# Altium schematic sheet Altium-Schematic.SchDoc
size 400 x 209 mm; SheetNumber: 1; SheetTotal: 1
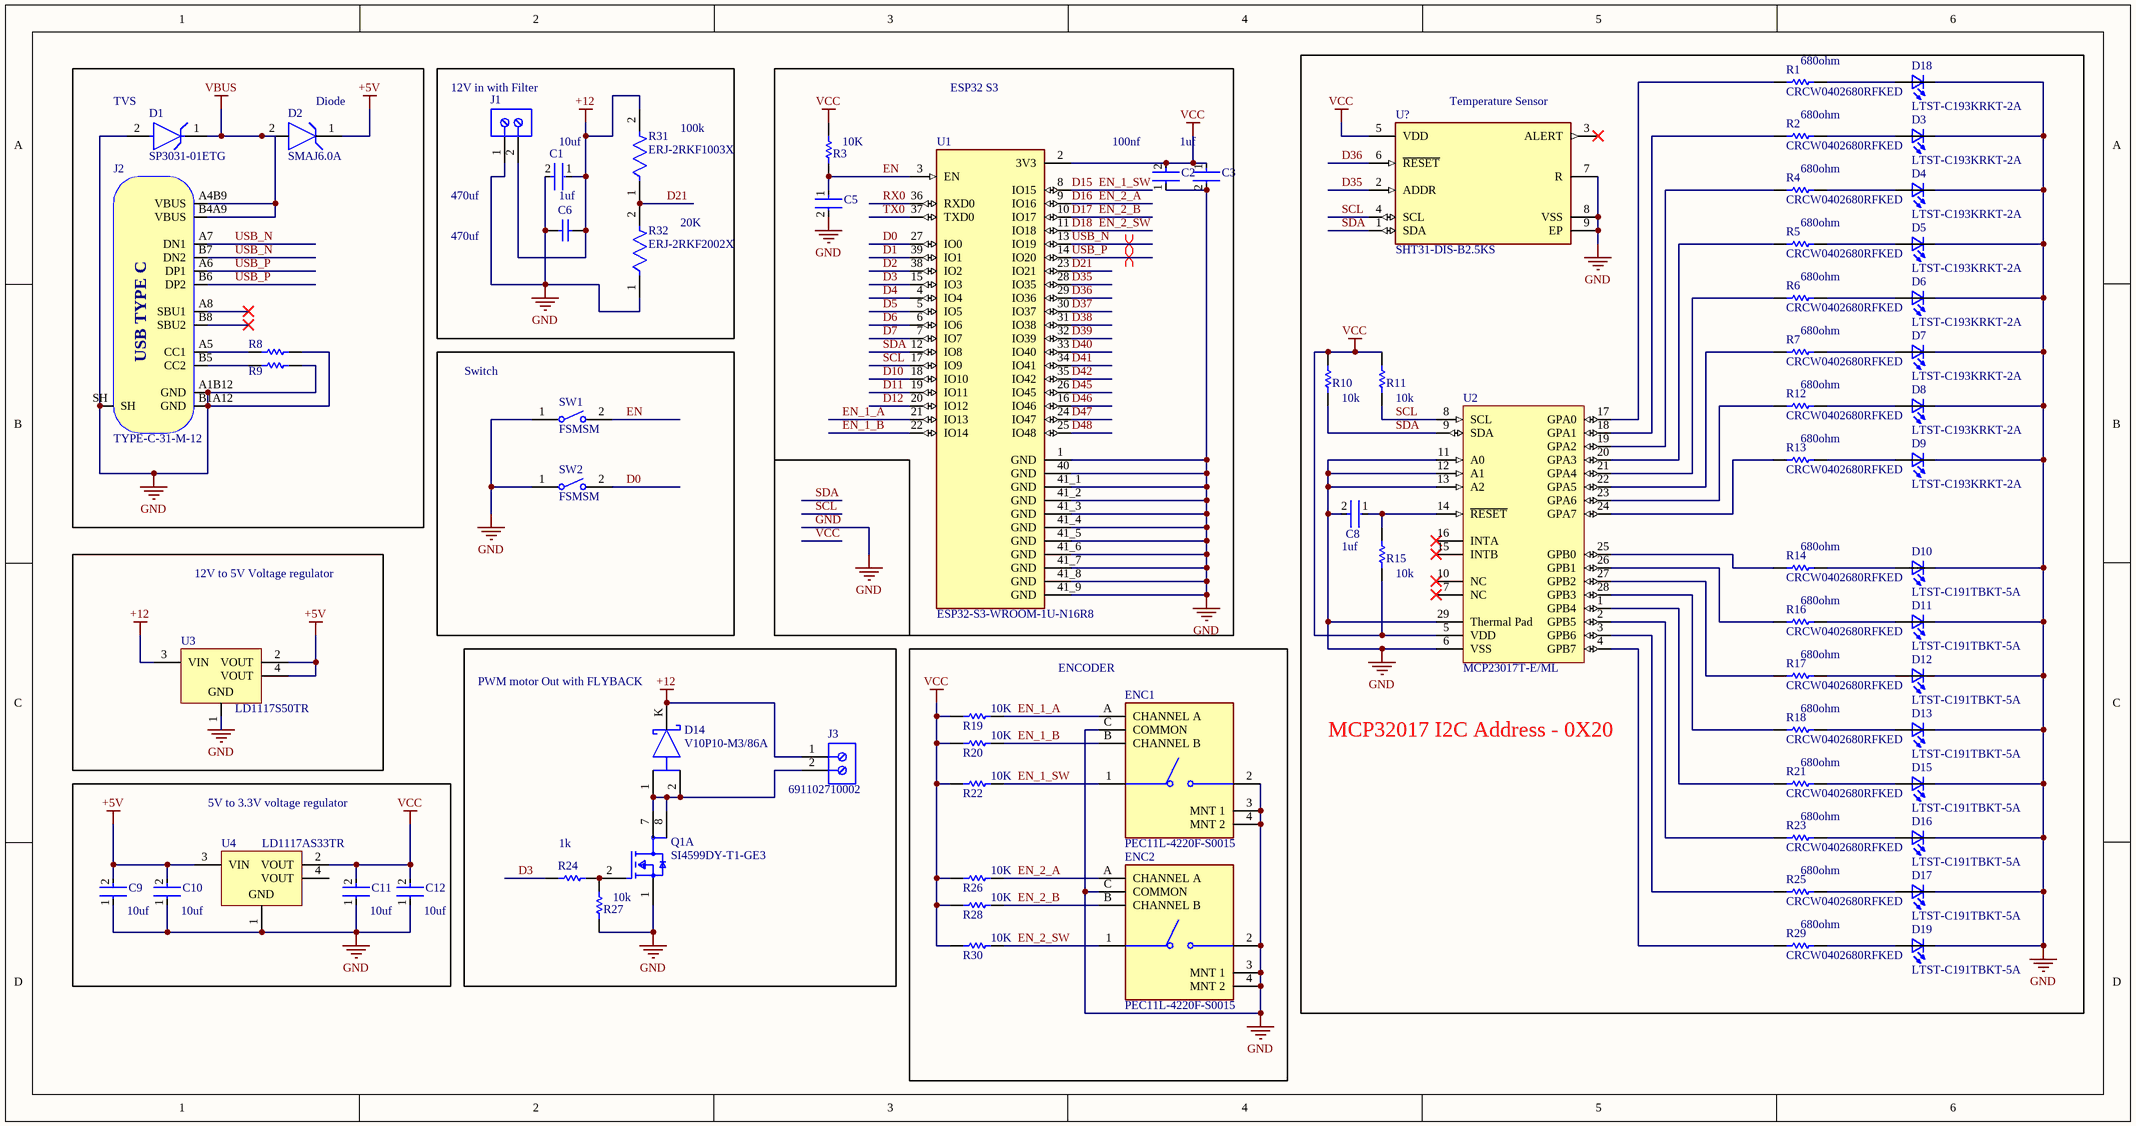
[diagram p0: Altium-Schematic.SchDoc]

## Parts
C1  C1608X5R1A106K080AC  [FP-C1608-080-0_1-MFG]  (value not drawn)
C2  GRM155R71C104KA88D  [FP-GRM15-MFG]  (value not drawn)
C3  EMK105BJ105KV-F  [FP-0402-L_1_0_0_05-W_0_5-IPC_A]  (value not drawn)
C5  EMK105BJ105KV-F  [FP-0402-L_1_0_0_05-W_0_5-IPC_A]  (value not drawn)
C6  C0603C105K4RACTU  [CAPC1608X90X35LL15T15]  (value not drawn)
C8  GRM155R71C104KA88D  [FP-GRM15-MFG]  (value not drawn)
C9  C1608X5R1A106K080AC  [FP-C1608-080-0_1-MFG]  (value not drawn)
C10  C1608X5R1A106K080AC  [FP-C1608-080-0_1-MFG]  (value not drawn)
C11  C1608X5R1A106K080AC  [FP-C1608-080-0_1-MFG]  (value not drawn)
C12  C1608X5R1A106K080AC  [FP-C1608-080-0_1-MFG]  (value not drawn)
D1  SP3031-01ETG  [FP-SP3031-MFG]
D2  SMAJ6.0A  [FP-SMA-MFG]
D3  LTST-C193KRKT-2A  [0603]
D4  LTST-C193KRKT-2A  [0603]
D5  LTST-C193KRKT-2A  [0603]
D6  LTST-C193KRKT-2A  [0603]
D7  LTST-C193KRKT-2A  [0603]
D8  LTST-C193KRKT-2A  [0603]
D9  LTST-C193KRKT-2A  [0603]
D10  LTST-C191TBKT-5A  [0603]
D11  LTST-C191TBKT-5A  [0603]
D12  LTST-C191TBKT-5A  [0603]
D13  LTST-C191TBKT-5A  [0603]
D14  V10P10-M3/86A  [FP-95570-MFG]
D15  LTST-C191TBKT-5A  [0603]
D16  LTST-C191TBKT-5A  [0603]
D17  LTST-C191TBKT-5A  [0603]
D18  LTST-C193KRKT-2A  [0603]
D19  LTST-C191TBKT-5A  [0603]
ENC1  PEC11L-4220F-S0015  [FP-PEC11L-4220F-S0015-MFG]
ENC2  PEC11L-4220F-S0015  [FP-PEC11L-4220F-S0015-MFG]
J1  691102710002  [691102710002]  (value not drawn)
J2  TYPE-C-31-M-12  [TYPE-C-31-M-12]
J3  691102710002  [691102710002]
Q1  SI4599DY-T1-GE3  [FP-C-06527-IPC_B]  (part A of 2)
R1  CRCW0402680RFKED  [RESC1005X40X25ML05T05]
R2  CRCW0402680RFKED  [RESC1005X40X25ML05T05]
R3  ERJ-2GEJ103X  [RESC1005X40X25ML05T05]  (value not drawn)
R4  CRCW0402680RFKED  [RESC1005X40X25ML05T05]
R5  CRCW0402680RFKED  [RESC1005X40X25ML05T05]
R6  CRCW0402680RFKED  [RESC1005X40X25ML05T05]
R7  CRCW0402680RFKED  [RESC1005X40X25ML05T05]
R8  RC0402FR-075K1L  [RESC1005X40X25NL05T10]  (value not drawn)
R9  RC0402FR-075K1L  [RESC1005X40X25NL05T10]  (value not drawn)
R10  ERJ-2GEJ103X  [RESC1005X40X25ML05T05]  (value not drawn)
R11  ERJ-2GEJ103X  [RESC1005X40X25ML05T05]  (value not drawn)
R12  CRCW0402680RFKED  [RESC1005X40X25ML05T05]
R13  CRCW0402680RFKED  [RESC1005X40X25ML05T05]
R14  CRCW0402680RFKED  [RESC1005X40X25ML05T05]
R15  ERJ-2GEJ103X  [RESC1005X40X25ML05T05]  (value not drawn)
R16  CRCW0402680RFKED  [RESC1005X40X25ML05T05]
R17  CRCW0402680RFKED  [RESC1005X40X25ML05T05]
R18  CRCW0402680RFKED  [RESC1005X40X25ML05T05]
R19  ERJ-2GEJ103X  [RESC1005X40X25ML05T05]  (value not drawn)
R20  ERJ-2GEJ103X  [RESC1005X40X25ML05T05]  (value not drawn)
R21  CRCW0402680RFKED  [RESC1005X40X25ML05T05]
R22  ERJ-2GEJ103X  [RESC1005X40X25ML05T05]  (value not drawn)
R23  CRCW0402680RFKED  [RESC1005X40X25ML05T05]
R24  ERJ-2GEJ102X  [RESC1005X40X25NL05T05]  (value not drawn)
R25  CRCW0402680RFKED  [RESC1005X40X25ML05T05]
R26  ERJ-2GEJ103X  [RESC1005X40X25ML05T05]  (value not drawn)
R27  ERJ-2GEJ103X  [RESC1005X40X25ML05T05]  (value not drawn)
R28  ERJ-2GEJ103X  [RESC1005X40X25ML05T05]  (value not drawn)
R29  CRCW0402680RFKED  [RESC1005X40X25ML05T05]
R30  ERJ-2GEJ103X  [RESC1005X40X25ML05T05]  (value not drawn)
R31  ERJ-2RKF1003X  [FP-ERJ2RK-IPC_C]
R32  ERJ-2RKF2002X  [FP-ERJ2RK-MFG]
SW1  FSMSM  [TECO-FSMSM-2_V]
SW2  FSMSM  [TECO-FSMSM-2_V]
U1  ESP32-S3-WROOM-1U-N16R8  [XCVR_ESP32-S3-WROOM-1U-N16R8]
U2  MCP23017T-E/ML  [QFN-ML28_M]
U3  LD1117S50TR  [SOT-223_L]
U4  LD1117AS33TR  [SOT-223_M]
U?  SHT31-DIS-B2.5KS  [FP-SHT31-DIS-B2_5KS-MFG]

## Blocks framed on the sheet
MCP32017 I2C Address - 0X20: C8 D3-D13 D15-D19 R1 R2 R4-R7 R10-R18 R21 R23 R25 R29 U2 U?
Switch: SW1 SW2
12V to 5V Voltage regulator: U3

## Nets
+5V: C9.2 C10.2 D2.1(C) U3.2(VOUT) U3.4(VOUT) U4.3(VIN)
+12: C1.1 C6.2 D14.K(C) J1.2 J3.1 R31.2 U3.3(VIN)
GND: C1.2 C2.1 C3.2 C5.2 C6.1 C8.2 C9.1 C10.1 C11.1 C12.1 D1.2(A) D3.1(K2) D4.1(K2) D5.1(K2) D6.1(K2) D7.1(K2) D8.1(K2) D9.1(K2) D10.1(K2) D11.1(K2) D12.1(K2) D13.1(K2) D15.1(K2) D16.1(K2) D17.1(K2) D18.1(K2) D19.1(K2) ENC1.2 ENC1.3(MNT_1) ENC1.4(MNT_2) ENC1.C(COMMON) ENC2.2 ENC2.3(MNT_1) ENC2.4(MNT_2) ENC2.C(COMMON) J1.1 J2.A1B12(GND) J2.B1A12(GND) J2.SH Q1.1(S1) R8.2 R9.2 R27.1 R32.1 SW1.1 SW2.1 U1.1(GND) U1.40(GND) U1.41_1(GND) U1.41_2(GND) U1.41_3(GND) U1.41_4(GND) U1.41_5(GND) U1.41_6(GND) U1.41_7(GND) U1.41_8(GND) U1.41_9(GND) U2.6(VSS) U2.11(A0) U2.12(A1) U2.13(A2) U2.29(Thermal_Pad) U3.1(GND) U4.1(GND) U?.7(R) U?.8(VSS) U?.9(EP)
VBUS: D1.1(C) D2.2(A) J2.A4B9(VBUS) J2.B4A9(VBUS)
VCC: C2.2 C3.1 C11.2 C12.2 R3.2 R10.2 R11.2 R15.1 R19.2 R20.2 R22.2 R26.2 R28.2 R30.2 U1.2(3V3) U2.5(VDD) U4.2(VOUT) U?.5(VDD)
D0: SW2.2 U1.27(IO0)
D1: U1.39(IO1)
D2: U1.38(IO2)
D3: R24.1 U1.15(IO3)
D4: U1.4(IO4)
D5: U1.5(IO5)
D6: U1.6(IO6)
D7: U1.7(IO7)
D10: U1.18(IO10)
D11: U1.19(IO11)
D12: U1.20(IO12)
D15: ENC1.1 R22.1 U1.8(IO15)  [also labelled EN_1_SW]
D16: ENC2.A(CHANNEL_A) R26.1 U1.9(IO16)  [also labelled EN_2_A]
D17: ENC2.B(CHANNEL_B) R28.1 U1.10(IO17)  [also labelled EN_2_B]
D18: ENC2.1 R30.1 U1.11(IO18)  [also labelled EN_2_SW]
D21: R31.1 R32.2 U1.23(IO21)
D35: U1.28(IO35) U?.2(ADDR)
D36: U1.29(IO36) U?.6(~{RESET})
D37: U1.30(IO37)
D38: U1.31(IO38)
D39: U1.32(IO39)
D40: U1.33(IO40)
D41: U1.34(IO41)
D42: U1.35(IO42)
D45: U1.26(IO45)
D46: U1.16(IO46)
D47: U1.24(IO47)
D48: U1.25(IO48)
EN: C5.1 R3.1 SW1.2 U1.3(EN)
EN_1_A: ENC1.A(CHANNEL_A) R19.1 U1.21(IO13)
EN_1_B: ENC1.B(CHANNEL_B) R20.1 U1.22(IO14)
RX0: U1.36(RXD0)
SCL: R11.1 U1.17(IO9) U2.8(SCL) U?.4(SCL)
SDA: R10.1 U1.12(IO8) U2.9(SDA) U?.1(SDA)
TX0: U1.37(TXD0)
USB_N: J2.A7(DN1) J2.B7(DN2) U1.13(IO19)
USB_P: J2.A6(DP1) J2.B6(DP2) U1.14(IO20)
NetC8_1: C8.1 R15.2 U2.14(~{RESET})
NetD3_2: D3.2(A2) R2.2
NetD4_2: D4.2(A2) R4.2
NetD5_2: D5.2(A2) R5.2
NetD6_2: D6.2(A2) R6.2
NetD7_2: D7.2(A2) R7.2
NetD8_2: D8.2(A2) R12.2
NetD9_2: D9.2(A2) R13.2
NetD10_2: D10.2(A2) R14.2
NetD11_2: D11.2(A2) R16.2
NetD12_2: D12.2(A2) R17.2
NetD13_2: D13.2(A2) R18.2
NetD14_1: D14.1(A) D14.2(A) J3.2 Q1.7(D1) Q1.8(D1)
NetD15_2: D15.2(A2) R21.2
NetD16_2: D16.2(A2) R23.2
NetD17_2: D17.2(A2) R25.2
NetD18_2: D18.2(A2) R1.2
NetD19_2: D19.2(A2) R29.2
NetJ2_A5: J2.A5(CC1) R8.1
NetJ2_B5: J2.B5(CC2) R9.1
NetQ1_2: Q1.2(G1) R24.2 R27.2
NetR1_1: R1.1 U2.17(GPA0)
NetR2_1: R2.1 U2.18(GPA1)
NetR4_1: R4.1 U2.19(GPA2)
NetR5_1: R5.1 U2.20(GPA3)
NetR6_1: R6.1 U2.21(GPA4)
NetR7_1: R7.1 U2.22(GPA5)
NetR12_1: R12.1 U2.23(GPA6)
NetR13_1: R13.1 U2.24(GPA7)
NetR14_1: R14.1 U2.25(GPB0)
NetR16_1: R16.1 U2.26(GPB1)
NetR17_1: R17.1 U2.27(GPB2)
NetR18_1: R18.1 U2.28(GPB3)
NetR21_1: R21.1 U2.1(GPB4)
NetR23_1: R23.1 U2.2(GPB5)
NetR25_1: R25.1 U2.3(GPB6)
NetR29_1: R29.1 U2.4(GPB7)

Not connected (* = marked no-connect by the designer): J2 A8(SBU1)* B8(SBU2)*; U2 7(NC)* 10(NC)* 15(INTB)* 16(INTA)*; U4 4(VOUT); U? 3(ALERT)*

## Layout directives
differential pair: USB_N, USB_P

## Notes on the sheet
- (near R1) 680ohm
- (near D1) TVS
- (near D2) Diode
- (near J1) 12V in with Filter
- (near R31) 100k
- ESP32 S3
- (near U?) Temperature Sensor
- (near R2) 680ohm
- 470uf
- 10uf
- (near C1) 1uf
- (near R3) 10K
- (near C2) 100nf
- 1uf
- (near R4) 680ohm
- 20K
- (near R5) 680ohm
- (near R6) 680ohm
- (near R7) 680ohm
- 10k
- (near R11) 10k
- (near R12) 680ohm
- (near R13) 680ohm
- (near R15) 10k
- (near R14) 680ohm
- (near R16) 680ohm
- ENCODER
- (near R17) 680ohm
- (near D14) PWM motor Out with FLYBACK
- (near R19) 10K
- (near R20) 10K
- (near R18) 680ohm
- 5V to 3.3V voltage regulator
- (near R22) 10K
- (near R21) 680ohm
- (near R24) 1k
- (near R26) 10K
- (near R23) 680ohm
- (near R25) 680ohm
- (near C12) 10uf
- (near R28) 10K
- (near R30) 10K
- (near R29) 680ohm
- (in symbol TYPE-C-31-M-12) USB TYPE C

## Library data of the parts
C1 C9-C12 = CMP-2000-04979-3: Multilayer Ceramic Capacitors 10μF ±10% 10V X5R SMD 0603; Capacitance: 10uF; Dielectric Material: Ceramic; Construction: Flat; Height: 0.8mm; Thickness: 0.035inch; Case Code (Metric): 1608; Radiation Hardening: No; Number of Pins: 2; Voltage Rating (DC): 10V; Depth: 0.8mm; Voltage: 10V; RoHS Compliant: Yes; Voltage Rating: 10V; Package Quantity: 1; Resistor Type: Ceramic; Termination: SMD/SMT; Lead Free: Lead Free; REACH SVHC: No SVHC; Tolerance: 10%; Mount: Surface Mount; Series: C; Packaging: Tape and Reel; Width: 0.8mm; Dielectric: X5R; Weight: 7.1E-05oz; Length: 1.6mm; Max Operating Temperature: 85°C; Case Code (Imperial): 0603; Case/Package: 0603; Min Operating Temperature: -55°C
C2 C8 = CMP-2100-03641-2: CAP CER 0.1UF 16V X7R 0402; Manufacturer: Murata; Standoff Height: 0mm; Tolerance: 10%; Voltage Rating: 16Vdc; Material: Ceramic; Capacitance: 0.10μF; Value: 0.10μF; RoHS: TRUE; Manufacturer Part Number: GRM155R71C104KA88D; Temperature Characteristic: X7R; Octopart: https://octopart.com/grm155r71c104ka88d-murata-196880; Digikey Description: CAP CER 0.1UF 16V X7R 0402; Device Class L3: Ceramic Capacitors; Height: 0.55mm; ComponentLink2Description: Datasheet; Temperature Range Low: -55°C; Ipc Land Pattern Name: CAPC10050X219; ComponentLink2URL: https://search.murata.co.jp/Ceramy/image/img/A01X/G101/ENG/GRM155R71H471KA01-01A.pdf; Device Class L1: Passive Components; Lead Free: yes; Category: Cap; Package: GRM15; Temperature: -55°C to +125°C; Device Class L2: Capacitors; Temperature Range High: +125°C; Mouser Description: 0402 0.1 uF 16V ±10 % Tolerance X7R SMT Multilayer Ceramic Capacitor
C3 C5 = CMP-14477-000104-2: None; Tolerance: 10%; Voltage Rating: 16V; Dielectric: X5R; Capacitance: 1uF; Packaging: Tape and Reel; Depth: 0.5mm; Mount: Surface Mount; Thickness: 0.022inch; Package Quantity: 1; Min Operating Temperature: -55°C; Series: M; Voltage Rating (DC): 16V; Termination: SMD/SMT; Case/Package: 0402; Number of Pins: 2; Case Code (Imperial): 0402; Length: 1mm; Halogen Free: Halogen Free; Case Code (Metric): 1005; Width: 0.02inch; RoHS Compliant: Yes; Radiation Hardening: No; Max Operating Temperature: 85°C; Height: 0.5mm; Construction: Flat
C6 = CMP-2006-02298-2: Manufacturer: Kemet; Part Number: C0603C105K4RACTU
D1 = CMP-08607-000052-1: TVS DIODE 5V 7.5V SOD882; Manufacturer: Littelfuse Inc; Capacitance: 0.8pF; Number Of Channels: 1; Value: 0.8pF; Automotive Grade: Grade 1; Direction: Unidirectional; Peak Pulse Current: 5A; Breakdown Voltage: 6V; Device Class L2: TVS Diodes; Temperature: -40°C to +125°C; ComponentLink2Description: Datasheet; Device Class L3: unset; Height: 0.6mm; RoHS: TRUE; Device Class L1: Circuit Protection; Reverse Standoff Voltage: 5V; Octopart: https://octopart.com/sp3031-01etg-littelfuse-22577615; Category: Diode; Lead Free: Yes; Manufacturer Part Number: SP3031-01ETG; Package: SP3031; Temperature Range High: +125°C; Automotive: Yes; Mouser Description: SP3031 Series 6 V 0.8 pF Uni-Directional TVS Diode Array - SOD-882; ComponentLink2URL: https://www.littelfuse.com/~/media/electronics/datasheets/tvs_diode_arrays/littelfuse_tvs_diode_array_sp3031_datasheet.pdf.pdf; Digikey Description: TVS DIODE 5V 7.5V SOD882; Temperature Range Low: -40°C; Clamping Voltage: 7.5V
D2 = CMP-07401-000002-1: TVS DIODE 6V 10.3V SMA; Manufacturer: Bourns Inc.; Max Junction Temp: +150°C; Peak Pulse Power: 400W; Breakdown Voltage: 6.67V; Peak Pulse Current: 38.8A; Direction: Unidirectional; Number Of Channels: 1; Clamping Voltage: 10.3V; Digikey Description: TVS DIODE 6V 10.3V SMA; Automotive: No; Octopart: https://octopart.com/smaj6.0a-bourns-12809397; Package: SMA; Temperature Range High: +150°C; Manufacturer Part Number: SMAJ6.0A; Device Class L2: TVS Diodes; Temperature Range Low: -55°C; ComponentLink2URL: https://www.bourns.com/docs/product-datasheets/smaj.pdf?sfvrsn=d2266a96_11; Lead Free: Yes; Device Class L1: Circuit Protection; Mouser Description: Diode TVS Single Uni-Dir 6V 400W 2-Pin SMA T/R; RoHS: TRUE; Height: 2.29mm; Category: Diode; Temperature: -55°C to +150°C; Reverse Standoff Voltage: 6V; ComponentLink2Description: Datasheet; Device Class L3: unset
D3-D9 D18 = LTST-C193KRKT-2A: Red 629nm LED Indication - Discrete 1.9V 0603 _1608 Metric_; MF: Lite-On Inc.; Digi-Key_Part_Number: 160-1909-1-ND; Value: *; MP: LTST-C193KRKT-2A; Package: 0603 Lite-On; SnapEDA_Link: https://www.snapeda.com/parts/LTST-C193KRKT-2A/Lite-On%20Inc./view-part/565233/?ref=snap; Digi-Key_Purchase_URL: https://www.digikey.com/product-detail/en/lite-on-inc/LTST-C193KRKT-2A/160-1909-1-ND/3694456?utm_source=snapeda&utm_medium=aggregator&utm_campaign=symbol
D10-D13 D15-D17 D19 = LTST-C191TBKT-5A: Blue 473nm LED Indication - Discrete 2.8V 0603 _1608 Metric_; MF: Lite-On Inc.; Package: 0603 Lite-On; Price: None; Availability: Unavailable; MP: LTST-C191TBKT-5A; SnapEDA_Link: https://www.snapeda.com/parts/LTST-C191TBKT-5A/Lite-On%20Inc./view-part/266129/?ref=snap; Value: *
D14 = CMP-2000-07483-2: DIODE SCHOTTKY 100V 10A TO277A; Manufacturer: Vishay; Max Junction Temp: +175°C; Max Surge Forward Current: 180A; Peak Reverse Current: 30.4uA; Digikey Description: DIODE SCHOTTKY 100V 10A TO277A; Manufacturer Part Number: V10P10-M3/86A; Device Class L1: Discrete Semiconductors; ComponentLink2Description: Datasheet; Reverse Voltage: 100V; Device Class L2: Diodes; Temperature Range Low: -40°C; Automotive: No; Package: 95570; Mouser Description: Diode Schottky 100V 10A 3-Pin(2+Tab) SMPC T/R; Lead Free: Yes; Footprint Url: https://www.vishay.com/docs/95570/to-277asmpc.pdf; Octopart: https://octopart.com/v10p10-m3%2F86a-vishay-42522004; Forward Current: 10A; Device Class L3: Schottky Diodes; RoHS: TRUE; Temperature Range High: +175°C; Temperature: -40°C to +175°C; ComponentLink2URL: http://www.vishay.com/docs/89006/v10p10.pdf; Category: Diode; Max Repetitive Reverse Voltage: 100V; Height: 1.2mm
ENC1 ENC2 = CMP-07421-000002-1: ROTARY ENCODER MECHANICAL 15PPR; Manufacturer: Bourns Inc.; Conn Orientation: Vertical; Voltage Rating Dc: 5V; Detent: Yes; Pulses Per Rev: 15; Current Rating: 10mA; Number Of Circuits: 1; Encoder Type: Incremental; Mouser Description: Encoders FLATTED SHAFT PUSH SWTCH 30DETENTS; Temperature Range High: +80°C; Device Class L1: Electromechanical; Octopart: https://octopart.com/pec11l-4220f-s0015-bourns-19504852; Height: 25.3mm; Device Class L2: Switches; Temperature: -25°C to +80°C; Device Class L3: Encoders; Lead Free: Yes; Manufacturer Part Number: PEC11L-4220F-S0015; Package: 0; ComponentLink2Description: Datasheet; Automotive: No; ComponentLink2URL: https://www.bourns.com/docs/product-datasheets/pec11l.pdf?sfvrsn=7b1089f1_8; Temperature Range Low: -25°C; Category: Enc; RoHS: TRUE; Digikey Description: ROTARY ENCODER MECHANICAL 15PPR
J1 J3 = CMP-1502-03258-2: NexarPartId: 8917706; Number of Levels: 1; Number of Positions Per Level: 2; Current: 15A; Voltage: 300V; Pitch: 5.0038mm; Plating: Steel; Stripping Length: -6mm; Wire Gauge (Min): 14AWG; Wire Gauge (Max): 22AWG; Length: 7.5mm; Contact Material: Brass; Contact Plating: Tin; Packaging: Box; Number of Pins: 2; Voltage Rating: 300V; Termination: Screw; Number of Contacts: 2; Color: Blue; Current Rating: 15A; Mount: Through Hole; Max Operating Temperature: 105°C; Min Operating Temperature: -40°C; REACH SVHC: Unknown; Height: 13.4mm; Width: 11.2mm; Housing Material: Nylon; RoHS: Compliant; Wire/Cable Gauge: 22AWG; Lead Pitch: 5mm
J2 = TYPE-C-31-M-12: USB Type C Connector Horizontal SMT; Manufacturer: Koren Hroparts; Manufacturer Part Number: TYPE-C-31-M-12
Q1 = CMP-02550-000305-1: MOSFET N/P-CH 40V 6.8A 8SOIC; Number of Elements: 2; Fall Time: 13ns; Input Capacitance: 640pF; Polarity: N-CHANNEL; Turn-On Delay Time: 44ns; Rds On Max: 35.5mR; Turn-Off Delay Time: 30ns; Power Dissipation: 2W; Max Power Dissipation: 3.1W; FET Type: N and P-Channel; Gate to Source Voltage (Vgs): 20V; On-State Resistance: 45mR; Rise Time: 33ns; Drain to Source Resistance: 37mR; Threshold Voltage: 1.4V; Weight: 0.019048oz; Length: 5mm; Max Operating Temperature: 150°C; Min Operating Temperature: -55°C; Continuous Drain Current (ID): 6.8A; Height: 1.55mm; Number of Pins: 8; Mount: Surface Mount; Radiation Hardening: No; Lead Free: Lead Free; Case/Package: SOIC; Packaging: Tape and Reel; Drain to Source Breakdown Voltage: 40V; Series: TrenchFET®; Width: 4mm; Contact Plating: Tin; Drain-source On Resistance-Max: 45mR; RoHS Compliant: Yes; Drain to Source Voltage (Vdss): 40V; Package Quantity: 2500; Number of Channels: 2
R1 R2 R4-R7 R12-R14 R16-R18 R21 R23 R25 R29 = CMP-2002-00166-1: Manufacturer: Vishay Dale; Part Number: CRCW0402680RFKED
R3 R10 R11 R15 R19 R20 R22 R26-R28 R30 = CMP-2002-00433-1: Manufacturer: Panasonic; Part Number: ERJ-2GEJ103X
R8 R9 = CMP-2002-07753-1: Manufacturer: Yageo / Phycomp; Part Number: RC0402FR-075K1L
R24 = CMP-2002-00432-1: Manufacturer: Panasonic; Part Number: ERJ-2GEJ102X
R31 = CMP-2002-00608-4: RES SMD 100K OHM 1% 1/10W 0402; Resistance: 100kR; Voltage Rating (DC): 50V; Power Rating: 100mW; Temperature Coefficient: 100ppm/°C; Case/Package: 0402; Length: 1mm; Package Quantity: 1; Radiation Hardening: No; Case Code (Metric): 1005; Contact Plating: Tin; Mount: Surface Mount; Depth: 0.5mm; Max Operating Temperature: 155°C; Lead Free: Lead Free; Width: 0.5mm; Composition: Thick Film; Case Code (Imperial): 0402; Tolerance: 1%; Termination: SMD/SMT; Number of Pins: 2; Height: 0.35mm; Voltage Rating: 50V; Military Standard: Not; REACH SVHC: No SVHC; Packaging: Tape and Reel; Min Operating Temperature: -55°C; Max Power Dissipation: 100mW; Features: Automotive AEC-Q200; Number of Terminations: 2
R32 = CMP-2002-00759-4: RES SMD 20K OHM 1% 1/10W 0402; Resistance: 20kR; Voltage Rating (DC): 50V; Power Rating: 100mW; Temperature Coefficient: 100ppm/°C; Radiation Hardening: No; Case/Package: 0402; Case Code (Metric): 1005; Min Operating Temperature: -55°C; Termination: SMD/SMT; Package Quantity: 1; Length: 1mm; Case Code (Imperial): 0402; Lead Free: Lead Free; Height: 0.35mm; Max Operating Temperature: 155°C; Depth: 0.5mm; Number of Terminations: 2; Military Standard: Not; Max Power Dissipation: 100mW; Tolerance: 1%; Composition: Thick Film; Weight: 2.8E-05oz; Features: Automotive AEC-Q200; Voltage Rating: 50V; Contact Plating: Tin; REACH SVHC: No SVHC; Width: 0.02inch; Packaging: Cut Tape; Mount: Surface Mount
SW1 SW2 = CMP-2000-07511-1: FSMSM Push Button Switch, 50 mA, -35 to 85 degC, 2-Pin SMD, RoHS, Bulk; Manufacturer: TE Connectivity; Actuator Length: 1.07mm; Electrical Life: 20000Cycles; Actuator Material: Polyamide; Current Rating: 50mA; Illumination Type: Illuminated; Voltage Rating (DC): 24V; Contact Resistance: 100mOhm; Case\/Package: SMD/SMT; Operating Force: 180gf; Switch Travel: 0.25mm; Max Voltage Rating (DC): 12V; Throw Configuration: SPST; Packaging: LoosePiece; Max Operating Temperature: 85degC; ELV: Compliant; Package Description: 2-Pin Surface Mount Device, Body 6 x 3.5 mm, Pitch 9.19 mm; RoHSCompliant: true; Manufacturer URL: http://www.te.com/; Contact Plating: Silver; Contact Material: Brass; Mounting Technology: SurfaceMount; Contact Current Rating: 50mA; Datasheet Version: Rev. C2, 08/2014; Datasheet URL: http://www.te.com/commerce/DocumentDelivery/DDEController?Action=showdoc&DocId=Customer+Drawing%7F1437566-3%7FC2%7Fpdf%7FEnglish%7FENG_CD_1437566-3_C2_1437566_3_1_c.dwg.pdf%7F1437566-3; Mechanical Life: 20000Cycles; Package Reference: FSMSM; REACH SVHC: Unknown; Orientation: Straight; Min Operating Temperature: -35degC; Lead Free: LeadFree; Termination: GullWing; Package Quantity: 1000; Mount: SurfaceMount
U1 = ESP32-S3-WROOM-1U-N16R8: Bluetooth, WiFi 802.11b/g/n, Bluetooth v5.0 Transceiver Module 2.4GHz Antenna Not Included, U.FL Surface Mount; MF: Espressif Systems; Package: None; Price: None; Value: *; SnapEDA_Link: https://www.snapeda.com/parts/ESP32-S3-WROOM-1U-N16R8/Espressif+Systems/view-part/?ref=snap; MP: ESP32-S3-WROOM-1U-N16R8; Availability: Unavailable; Check_prices: https://www.snapeda.com/parts/ESP32-S3-WROOM-1U-N16R8/Espressif+Systems/view-part/?ref=eda
U2 = CMP-0186-00119-2: 16-Bit I/O Expander with Serial Interface, 28-Pin QFN, Extended Temperature, Tape and Reel; RevisionNote: URLs added.; PackageDescription: 28-Lead Plastic Quad Flat, No Lead Package (ML) - 6x6 mm Body [QFN] with 0.55 mm Contact Length; ComponentLink3Description: Package Specification; ComponentLink2URL: http://ww1.microchip.com/downloads/en/DeviceDoc/21952b.pdf; PackageVersion: revBB, Aug-2009; PackageReference: QFN-ML28; ComponentLink2Description: Datasheet; ComponentLink1URL: http://www.microchip.com/; DatasheetVersion: revB, Feb-2007; ComponentLink3URL: http://www.microchip.com/stellent/groups/techpub_sg/documents/packagingspec/en012702.pdf; Code_JEDEC: MO-220; ComponentLink1Description: Manufacturer URL
U3 = CMP-0244-00312-1: Fixed Low Drop Positive Voltage Regulator, 5V, 4-Pin SOT-223, Tape and Reel; ComponentLink1URL: http://www.st.com; DatasheetVersion: 1/11/2011; PackageDescription: 4-Pin SOT-223 Package, 6.5 x 3.5 mm Body, 2.3 mm Pitch, 7 mm Lead Span; ComponentLink2URL: http://www.st.com/internet/com/TECHNICAL_RESOURCES/TECHNICAL_LITERATURE/DATASHEET/CD00000544.pdf; ComponentLink1Description: Manufacturer URL; PackageReference: SOT-223; PackageVersion: 2010; ComponentLink2Description: Datasheet
U4 = CMP-0244-00316-1: 1A, Low Drop Positive Voltage Regulator, 3.3V, 4-Pin SOT-223, Tape and Reel; ComponentLink1Description: Manufacturer URL; DatasheetVersion: 2/12/2011; PackageVersion: 2010; ComponentLink1URL: http://www.st.com; ComponentLink2Description: Datasheet; ComponentLink2URL: http://www.st.com/internet/com/TECHNICAL_RESOURCES/TECHNICAL_LITERATURE/DATASHEET/CD00002116.pdf; PackageDescription: 4-Pin SOT-223 Package, 6.5 x 3.5 mm Body, 2.3 mm Pitch, 7 mm Lead Span; PackageReference: SOT-223
U? = CMP-144040-000009-1: SENSOR HUMID/TEMP 5V I2C 2% SMD; RoHS Compliant: Yes